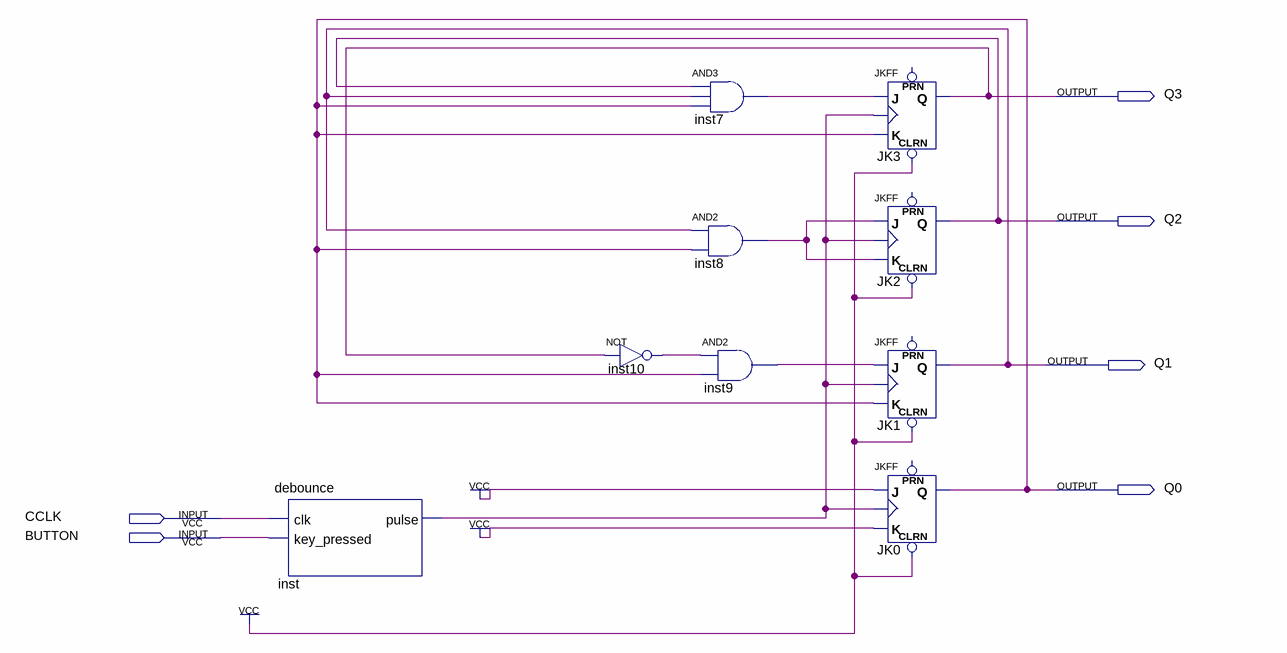
[diagram p0: schematic sheet]
// Quartus schematic counter2.bdf as structural Verilog: 9 symbols, 6 pins
module counter2 (
  input  CCLK,
  input  BUTTON,
  output Q3,
  output Q2,
  output Q1,
  output Q0
);

  wire inst7_out, inst8_out, inst9_out, inst10_out, inst_pulse;

  debounce inst (.clk(CCLK), .key_pressed(BUTTON), .pulse(inst_pulse));
  not inst10 (inst10_out, Q3);
  and inst7 (inst7_out, Q2, Q1, Q0);
  and inst8 (inst8_out, Q1, Q0);
  and inst9 (inst9_out, inst10_out, Q0);
  JKFF JK3 (.CLRN(1'b1), .K(Q0), .J(inst7_out), .CLK(inst_pulse), .Q(Q3));  // open: PRN
  JKFF JK2 (.CLRN(1'b1), .K(inst8_out), .J(inst8_out), .CLK(inst_pulse), .Q(Q2));  // open: PRN
  JKFF JK1 (.CLRN(1'b1), .K(Q0), .J(inst9_out), .CLK(inst_pulse), .Q(Q1));  // open: PRN
  JKFF JK0 (.CLRN(1'b1), .K(1'b1), .J(1'b1), .CLK(inst_pulse), .Q(Q0));  // open: PRN
endmodule
